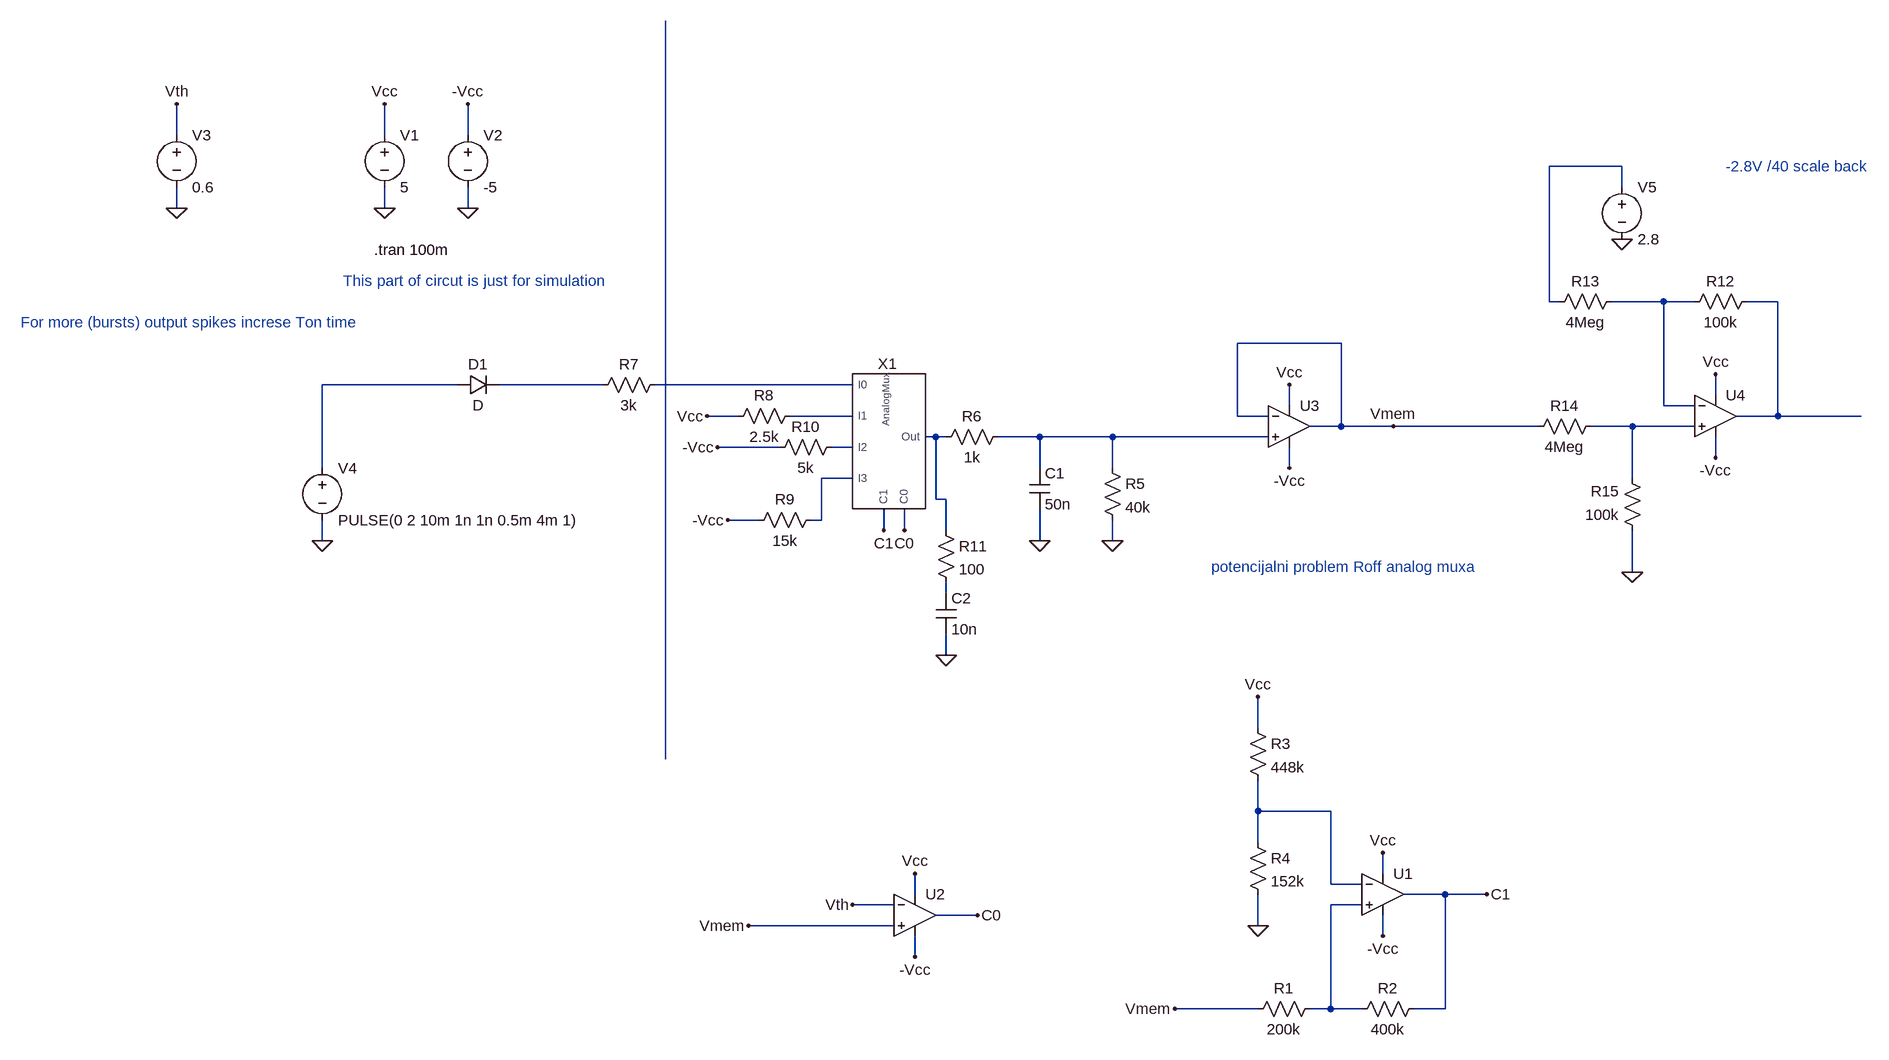
[diagram p0: schematic LIF_V3.asc]
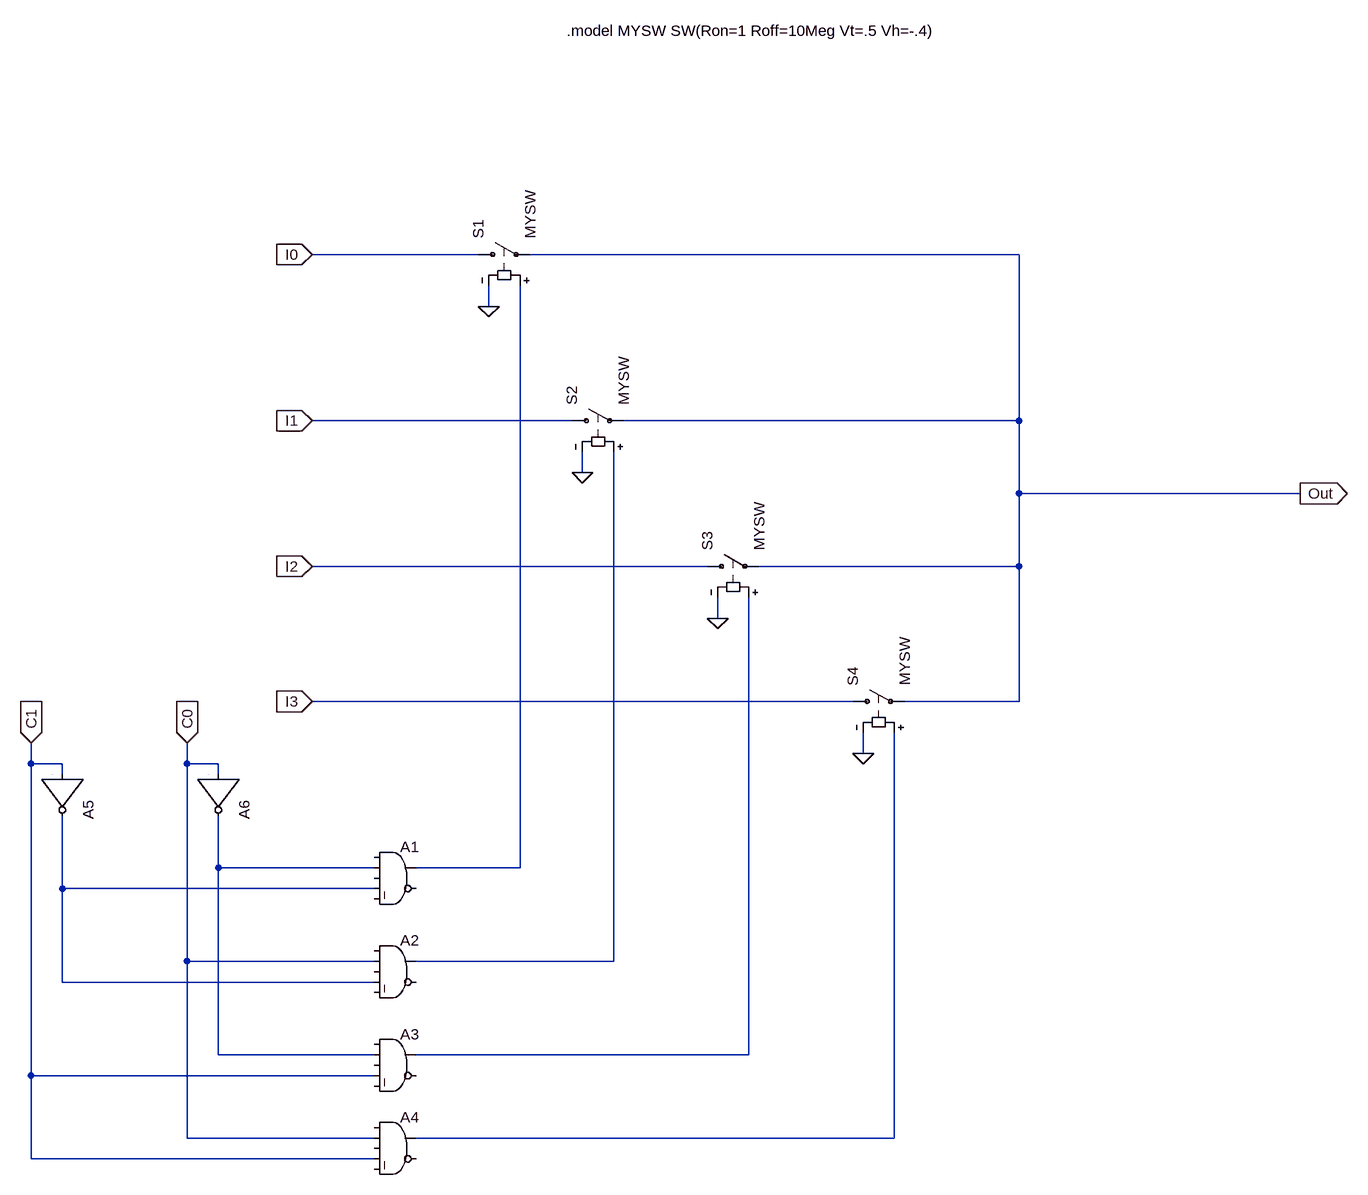
[diagram p1: sub-circuit analogmux.asc]
LIF_V3.asc, the LTspice schematic file:
Version 4
SHEET 1 1572 1160
WIRE -1056 -368 -1056 -416
WIRE -736 -368 -736 -416
WIRE -608 -368 -608 -416
WIRE 1168 -320 1056 -320
WIRE 1168 -288 1168 -320
WIRE -1056 -256 -1056 -288
WIRE -736 -256 -736 -288
WIRE -608 -256 -608 -288
WIRE 1056 -112 1056 -320
WIRE 1072 -112 1056 -112
WIRE 1232 -112 1152 -112
WIRE 1280 -112 1232 -112
WIRE 1408 -112 1360 -112
WIRE 736 -48 576 -48
WIRE -624 16 -832 16
WIRE -400 16 -560 16
WIRE -16 16 -320 16
WIRE 1312 32 1312 0
WIRE 656 48 656 16
WIRE 1232 48 1232 -112
WIRE 1280 48 1232 48
WIRE -192 64 -240 64
WIRE -16 64 -112 64
WIRE 576 64 576 -48
WIRE 624 64 576 64
WIRE 1408 64 1408 -112
WIRE 1408 64 1344 64
WIRE 1536 64 1408 64
WIRE 736 80 736 -48
WIRE 736 80 688 80
WIRE 816 80 736 80
WIRE 1040 80 816 80
WIRE 1184 80 1120 80
WIRE 1280 80 1184 80
WIRE 112 96 96 96
WIRE 128 96 112 96
WIRE 272 96 208 96
WIRE 384 96 272 96
WIRE 624 96 384 96
WIRE -128 112 -224 112
WIRE -16 112 -48 112
WIRE 1312 128 1312 96
WIRE -832 144 -832 16
WIRE 272 144 272 96
WIRE 384 144 384 96
WIRE 656 144 656 112
WIRE -16 160 -64 160
WIRE 1184 160 1184 80
WIRE 112 192 112 96
WIRE 128 192 112 192
WIRE -160 224 -208 224
WIRE -64 224 -64 160
WIRE -64 224 -80 224
WIRE 32 240 32 208
WIRE 64 240 64 208
WIRE 128 240 128 192
WIRE -832 256 -832 224
WIRE 272 256 272 208
WIRE 384 256 384 224
WIRE 1184 304 1184 240
WIRE 128 336 128 320
WIRE 128 432 128 400
WIRE 608 544 608 496
WIRE -304 592 -304 -544
WIRE 608 672 608 624
WIRE 720 672 608 672
WIRE 608 720 608 672
WIRE 800 768 800 736
WIRE 720 784 720 672
WIRE 768 784 720 784
WIRE 80 800 80 768
WIRE 896 800 832 800
WIRE 960 800 896 800
WIRE 48 816 -16 816
WIRE 768 816 720 816
WIRE 176 832 112 832
WIRE 48 848 -176 848
WIRE 608 848 608 800
WIRE 800 864 800 832
WIRE 80 896 80 864
WIRE 608 976 480 976
WIRE 720 976 720 816
WIRE 720 976 688 976
WIRE 768 976 720 976
WIRE 896 976 896 800
WIRE 896 976 848 976
FLAG 608 848 0
FLAG 608 496 Vcc
FLAG 800 736 Vcc
FLAG 800 864 -Vcc
FLAG -736 -256 0
FLAG -608 -256 0
FLAG -736 -416 Vcc
FLAG -608 -416 -Vcc
FLAG 80 768 Vcc
FLAG 80 896 -Vcc
FLAG -1056 -256 0
FLAG -1056 -416 Vth
FLAG -16 816 Vth
FLAG 272 256 0
FLAG 384 256 0
FLAG 816 80 Vmem
FLAG 480 976 Vmem
FLAG -176 848 Vmem
FLAG 176 832 C0
FLAG 64 240 C0
FLAG 32 240 C1
FLAG 960 800 C1
FLAG -240 64 Vcc
FLAG -224 112 -Vcc
FLAG -208 224 -Vcc
FLAG -832 256 0
FLAG 656 16 Vcc
FLAG 656 144 -Vcc
FLAG 128 432 0
FLAG 1312 0 Vcc
FLAG 1312 128 -Vcc
FLAG 1184 304 0
FLAG 1168 -208 0
SYMBOL AnalogMux 32 96 R0
SYMATTR InstName X1
SYMBOL OpAmps\\UniversalOpAmp2 800 800 R0
SYMATTR InstName U1
SYMBOL res 704 960 R90
WINDOW 0 0 56 VBottom 2
WINDOW 3 32 56 VTop 2
SYMATTR InstName R1
SYMATTR Value 200k
SYMBOL res 864 960 R90
WINDOW 0 0 56 VBottom 2
WINDOW 3 32 56 VTop 2
SYMATTR InstName R2
SYMATTR Value 400k
SYMBOL res 592 528 R0
SYMATTR InstName R3
SYMATTR Value 448k
SYMBOL res 592 704 R0
SYMATTR InstName R4
SYMATTR Value 152k
SYMBOL voltage -736 -384 R0
WINDOW 123 0 0 Left 0
WINDOW 39 0 0 Left 0
SYMATTR InstName V1
SYMATTR Value 5
SYMBOL voltage -608 -384 R0
WINDOW 123 0 0 Left 0
WINDOW 39 0 0 Left 0
SYMATTR InstName V2
SYMATTR Value -5
SYMBOL OpAmps\\UniversalOpAmp2 80 832 R0
SYMATTR InstName U2
SYMBOL voltage -1056 -384 R0
WINDOW 123 0 0 Left 0
WINDOW 39 0 0 Left 0
SYMATTR InstName V3
SYMATTR Value 0.6
SYMBOL cap 256 144 R0
SYMATTR InstName C1
SYMATTR Value 50n
SYMBOL res 368 128 R0
SYMATTR InstName R5
SYMATTR Value 40k
SYMBOL res 224 80 R90
WINDOW 0 0 56 VBottom 2
WINDOW 3 32 56 VTop 2
SYMATTR InstName R6
SYMATTR Value 1k
SYMBOL res -304 0 R90
WINDOW 0 0 56 VBottom 2
WINDOW 3 32 56 VTop 2
SYMATTR InstName R7
SYMATTR Value 3k
SYMBOL voltage -832 128 R0
WINDOW 123 0 0 Left 0
WINDOW 39 0 0 Left 0
SYMATTR InstName V4
SYMATTR Value PULSE(0 2 10m 1n 1n 0.5m 4m 1)
SYMBOL res -64 208 R90
WINDOW 0 0 56 VBottom 2
WINDOW 3 32 56 VTop 2
SYMATTR InstName R9
SYMATTR Value 15k
SYMBOL diode -624 32 R270
WINDOW 0 32 32 VTop 2
WINDOW 3 0 32 VBottom 2
SYMATTR InstName D1
SYMBOL res -32 96 R90
WINDOW 0 0 56 VBottom 2
WINDOW 3 32 56 VTop 2
SYMATTR InstName R10
SYMATTR Value 5k
SYMBOL res -96 48 R90
WINDOW 0 0 56 VBottom 2
WINDOW 3 32 56 VTop 2
SYMATTR InstName R8
SYMATTR Value 2.5k
SYMBOL OpAmps\\UniversalOpAmp2 656 80 R0
SYMATTR InstName U3
SYMBOL cap 112 336 R0
SYMATTR InstName C2
SYMATTR Value 10n
SYMBOL res 112 224 R0
SYMATTR InstName R11
SYMATTR Value 100
SYMBOL OpAmps\\UniversalOpAmp2 1312 64 R0
SYMATTR InstName U4
SYMBOL res 1376 -128 R90
WINDOW 0 0 56 VBottom 2
WINDOW 3 32 56 VTop 2
SYMATTR InstName R12
SYMATTR Value 100k
SYMBOL res 1168 -128 R90
WINDOW 0 0 56 VBottom 2
WINDOW 3 32 56 VTop 2
SYMATTR InstName R13
SYMATTR Value 4Meg
SYMBOL res 1136 64 R90
WINDOW 0 0 56 VBottom 2
WINDOW 3 32 56 VTop 2
SYMATTR InstName R14
SYMATTR Value 4Meg
SYMBOL res 1200 256 R180
WINDOW 0 36 76 Left 2
WINDOW 3 36 40 Left 2
SYMATTR InstName R15
SYMATTR Value 100k
SYMBOL voltage 1168 -304 R0
WINDOW 123 0 0 Left 0
WINDOW 39 0 0 Left 0
SYMATTR InstName V5
SYMATTR Value 2.8
TEXT -752 -192 Left 2 !.tran 100m
TEXT 536 296 Left 2 ;potencijalni problem Roff analog muxa
TEXT 1328 -320 Left 2 ;-2.8V /40 scale back
TEXT -1296 -80 Left 2 ;For more (bursts) output spikes increse Ton time
TEXT -800 -144 Left 2 ;This part of circut is just for simulation

analogmux.asc, the sub-circuit schematic file:
Version 4
SHEET 1 1540 1496
WIRE 176 16 -80 16
WIRE 1008 16 256 16
WIRE 192 96 192 64
WIRE 320 272 -80 272
WIRE 1008 272 1008 16
WIRE 1008 272 400 272
WIRE 336 352 336 320
WIRE 1008 384 1008 272
WIRE 1440 384 1008 384
WIRE 528 496 -80 496
WIRE 1008 496 1008 384
WIRE 1008 496 608 496
WIRE 544 576 544 544
WIRE 752 704 -80 704
WIRE 1008 704 1008 496
WIRE 1008 704 832 704
WIRE 768 784 768 752
WIRE -512 800 -512 768
WIRE -464 800 -512 800
WIRE -272 800 -272 768
WIRE -224 800 -272 800
WIRE -464 816 -464 800
WIRE -224 816 -224 800
WIRE -224 960 -224 880
WIRE 16 960 -224 960
WIRE 240 960 240 64
WIRE 240 960 80 960
WIRE -464 992 -464 880
WIRE 16 992 -464 992
WIRE -272 1104 -272 800
WIRE 16 1104 -272 1104
WIRE 384 1104 384 320
WIRE 384 1104 80 1104
WIRE -464 1136 -464 992
WIRE 16 1136 -464 1136
WIRE -224 1248 -224 960
WIRE 16 1248 -224 1248
WIRE 592 1248 592 544
WIRE 592 1248 80 1248
WIRE -512 1280 -512 800
WIRE 16 1280 -512 1280
WIRE -272 1376 -272 1104
WIRE 16 1376 -272 1376
WIRE 816 1376 816 752
WIRE 816 1376 80 1376
WIRE -512 1408 -512 1280
WIRE 16 1408 -512 1408
FLAG 336 352 0
FLAG 544 576 0
FLAG 768 784 0
FLAG -512 768 C1
IOPIN -512 768 In
FLAG -272 768 C0
IOPIN -272 768 In
FLAG -80 16 I0
IOPIN -80 16 In
FLAG -80 272 I1
IOPIN -80 272 In
FLAG -80 496 I2
IOPIN -80 496 In
FLAG -80 704 I3
IOPIN -80 704 In
FLAG 1440 384 Out
IOPIN 1440 384 Out
FLAG 192 96 0
SYMBOL sw 160 16 R270
SYMATTR InstName S1
SYMATTR Value MYSW
SYMBOL sw 304 272 R270
SYMATTR InstName S2
SYMATTR Value MYSW
SYMBOL sw 512 496 R270
SYMATTR InstName S3
SYMATTR Value MYSW
SYMBOL sw 736 704 R270
SYMATTR InstName S4
SYMATTR Value MYSW
SYMBOL Digital\\and 48 912 R0
SYMATTR InstName A1
SYMBOL Digital\\and 48 1056 R0
SYMATTR InstName A2
SYMBOL Digital\\and 48 1200 R0
SYMATTR InstName A3
SYMBOL Digital\\and 48 1328 R0
SYMATTR InstName A4
SYMBOL Digital\\inv -400 816 R90
SYMATTR InstName A5
SYMBOL Digital\\inv -160 816 R90
SYMATTR InstName A6
TEXT 312 -328 Left 2 !.model MYSW SW(Ron=1 Roff=10Meg Vt=.5 Vh=-.4)

The netlist it stands for:
* LIF_V3.asc
XX1 C0 C1 N006 N007 N011 N012 N009 analogmux
XU1 N016 N015 Vcc -Vcc C1 level2 Avol=1Meg GBW=10Meg Slew=10Meg Ilimit=25m Rail=0 Vos=0 En=0 Enk=0 In=0 Ink=0 Rin=500Meg  ; pins In+ In- V+ V- OUT
R1 N016 Vmem 200k
R2 C1 N016 400k
R3 Vcc N015 448k
R4 N015 0 152k
V1 Vcc 0 5
V2 -Vcc 0 -5
XU2 Vmem Vth Vcc -Vcc C0 level2 Avol=1Meg GBW=10Meg Slew=10Meg Ilimit=25m Rail=0 Vos=0 En=0 Enk=0 In=0 Ink=0 Rin=500Meg  ; pins In+ In- V+ V- OUT
V3 Vth 0 0.6
C1 N010 0 50n
R5 N010 0 40k
R6 N010 N009 1k
R7 N006 N005 3k
V4 N004 0 PULSE(0 2 10m 1n 1n 0.5m 4m 1)
R9 N012 -Vcc 15k
D1 N004 N005 D
R10 N011 -Vcc 5k
R8 N007 Vcc 2.5k
XU3 N010 Vmem Vcc -Vcc Vmem level2 Avol=1Meg GBW=10Meg Slew=10Meg Ilimit=25m Rail=0 Vos=0 En=0 Enk=0 In=0 Ink=0 Rin=500Meg  ; pins In+ In- V+ V- OUT
C2 N013 0 10n
R11 N009 N013 100
XU4 N008 N002 Vcc -Vcc N003 level2 Avol=1Meg GBW=10Meg Slew=10Meg Ilimit=25m Rail=0 Vos=0 En=0 Enk=0 In=0 Ink=0 Rin=500Meg  ; pins In+ In- V+ V- OUT
R12 N003 N002 100k
R13 N002 N001 4Meg
R14 N008 Vmem 4Meg
R15 0 N008 100k
V5 N001 0 2.8

* block symbol definitions
.subckt analogmux C0 C1 I0 I1 I2 I3 Out
S1 I0 Out N002 0 MYSW
S2 I1 Out N004 0 MYSW
S3 I2 Out N005 0 MYSW
S4 I3 Out N006 0 MYSW
A1 0 N001 0 N003 0 0 N002 0 AND
A2 0 C0 0 N003 0 0 N004 0 AND
A3 0 N001 0 C1 0 0 N005 0 AND
A4 0 C0 0 C1 0 0 N006 0 AND
A5 C1 0 0 0 0 N003 0 0 BUF
A6 C0 0 0 0 0 N001 0 0 BUF
.model MYSW SW(Ron=1 Roff=10Meg Vt=.5 Vh=-.4)
.ends analogmux

.model D D
.lib standard.dio
.tran 100m
* potencijalni problem Roff analog muxa
* -2.8V /40 scale back
* For more (bursts) output spikes increse Ton time
* This part of circut is just for simulation
.lib UniversalOpAmp2.lib
.backanno
.end